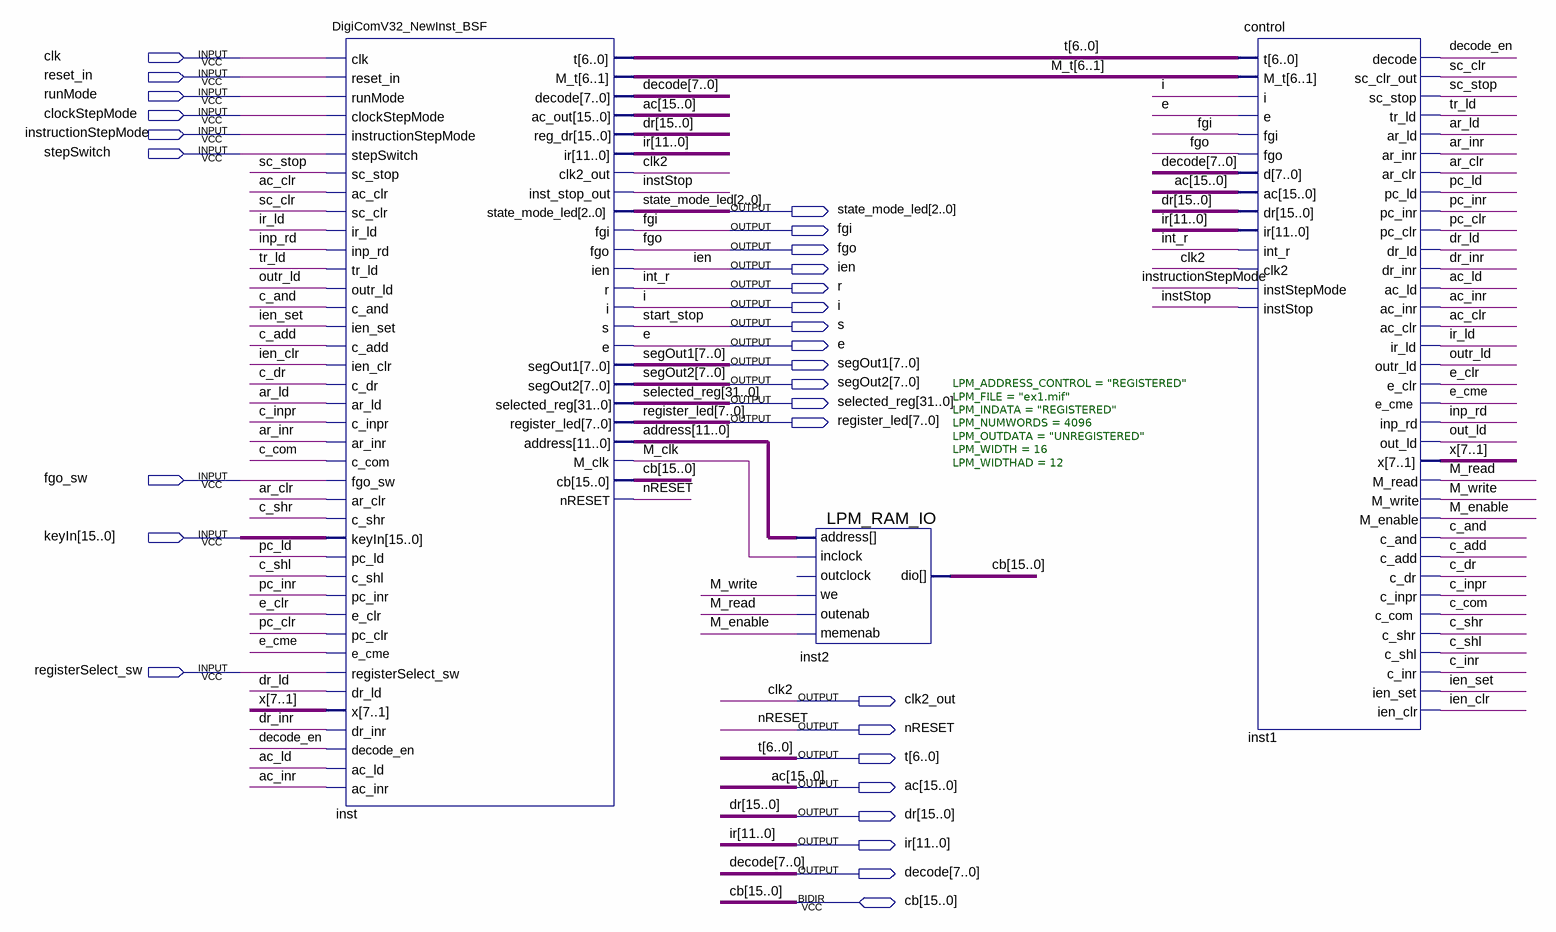
[diagram p0: schematic sheet]
// Quartus schematic DigiComV32_NewInst.bdf as structural Verilog: 3 symbols, 29 pins
module DigiComV32_NewInst (
  input  clk,
  input  reset_in,
  input  runMode,
  input  clockStepMode,
  input  instructionStepMode,
  input  stepSwitch,
  input  fgo_sw,
  input  [15:0] keyIn,
  input  registerSelect_sw,
  inout  [15:0] cb,
  output [2:0] state_mode_led,
  output fgi,
  output fgo,
  output ien,
  output r,
  output i,
  output s,
  output e,
  output [7:0] segOut1,
  output [7:0] segOut2,
  output [31:0] selected_reg,
  output [7:0] register_led,
  output clk2_out,
  output nRESET,
  output [6:0] t,
  output [15:0] ac,
  output [15:0] dr,
  output [11:0] ir,
  output [7:0] decode
);

  wire ac_clr, ac_inr, ac_ld, ar_clr, ar_inr, ar_ld, c_add, c_and, c_com, c_dr, c_inpr, c_inr, c_shl, c_shr,
       decode_en, dr_inr, dr_ld, e_clr, e_cme, ien_clr, ien_set, inp_rd, instStop, ir_ld, M_clk, M_enable,
       M_read, M_write, out_ld, outr_ld, pc_clr, pc_inr, pc_ld, sc_clr, sc_stop, tr_ld;
  wire [6:1] M_t;
  wire [7:1] x;
  wire [11:0] address;

  DigiComV32_NewInst_BSF inst (
    .clk(clk), .reset_in(reset_in), .runMode(runMode), .clockStepMode(clockStepMode),
    .instructionStepMode(instructionStepMode), .stepSwitch(stepSwitch), .sc_stop(sc_stop), .ac_clr(ac_clr),
    .sc_clr(sc_clr), .ir_ld(ir_ld), .inp_rd(inp_rd), .tr_ld(tr_ld), .outr_ld(outr_ld), .c_and(c_and),
    .ien_set(ien_set), .c_add(c_add), .ien_clr(ien_clr), .c_dr(c_dr), .ar_ld(ar_ld), .c_inpr(c_inpr),
    .ar_inr(ar_inr), .c_com(c_com), .fgo_sw(fgo_sw), .ar_clr(ar_clr), .c_shr(c_shr), .keyIn(keyIn),
    .pc_ld(pc_ld), .c_shl(c_shl), .pc_inr(pc_inr), .e_clr(e_clr), .pc_clr(pc_clr), .e_cme(e_cme),
    .registerSelect_sw(registerSelect_sw), .dr_ld(dr_ld), .x(x), .dr_inr(dr_inr), .decode_en(decode_en),
    .ac_ld(ac_ld), .ac_inr(ac_inr), .t(t), .M_t(M_t), .decode(decode), .ac_out(ac), .reg_dr(dr), .ir(ir),
    .clk2_out(clk2_out), .inst_stop_out(instStop), .state_mode_led(state_mode_led), .fgi(fgi), .fgo(fgo),
    .ien(ien), .r(r), .i(i), .s(s), .e(e), .segOut1(segOut1), .segOut2(segOut2), .selected_reg(selected_reg),
    .register_led(register_led), .address(address), .M_clk(M_clk), .cb(cb), .nRESET(nRESET));
  LPM_RAM_IO #(.LPM_ADDRESS_CONTROL("REGISTERED"), .LPM_FILE("ex1.mif"), .LPM_INDATA("REGISTERED"), .LPM_NUMWORDS(4096), .LPM_OUTDATA("UNREGISTERED"), .LPM_WIDTH(16), .LPM_WIDTHAD(12)) inst2 (
    .address(address), .memenab(M_enable), .inclock(M_clk), .we(M_write), .outenab(M_read), .dio(cb));  // open: outclock
  control inst1 (
    .t(t), .M_t(M_t), .i(i), .e(e), .fgi(fgi), .fgo(fgo), .d(decode), .ac(ac), .dr(dr), .ir(ir), .int_r(r),
    .clk2(clk2_out), .instStepMode(instructionStepMode), .instStop(instStop), .decode(decode_en),
    .sc_clr_out(sc_clr), .sc_stop(sc_stop), .tr_ld(tr_ld), .ar_ld(ar_ld), .ar_inr(ar_inr), .ar_clr(ar_clr),
    .pc_ld(pc_ld), .pc_inr(pc_inr), .pc_clr(pc_clr), .dr_ld(dr_ld), .dr_inr(dr_inr), .ac_ld(ac_ld),
    .ac_inr(ac_inr), .ac_clr(ac_clr), .ir_ld(ir_ld), .outr_ld(outr_ld), .e_clr(e_clr), .e_cme(e_cme),
    .inp_rd(inp_rd), .out_ld(out_ld), .x(x), .M_read(M_read), .M_write(M_write), .M_enable(M_enable),
    .c_and(c_and), .c_add(c_add), .c_dr(c_dr), .c_inpr(c_inpr), .c_com(c_com), .c_shr(c_shr), .c_shl(c_shl),
    .c_inr(c_inr), .ien_set(ien_set), .ien_clr(ien_clr));

  // Other names for the same wires on the sheet: clk2 = clk2_out; int_r = r; start_stop = s
endmodule
